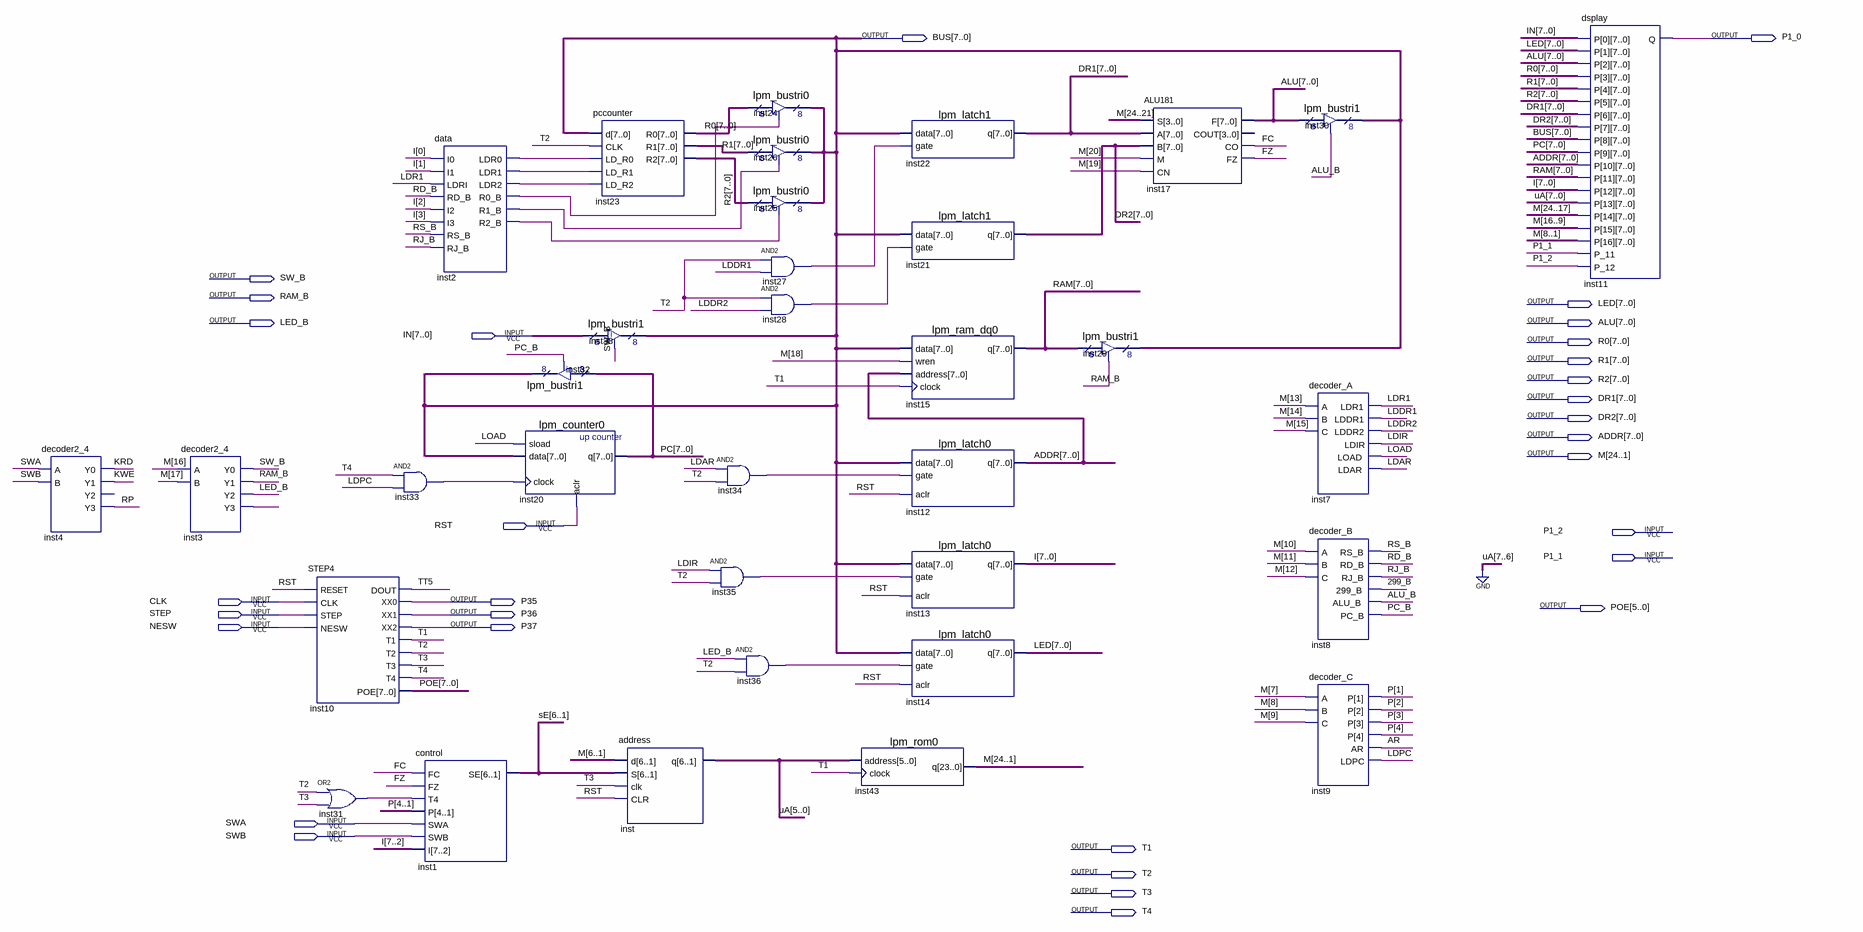
[diagram p0: schematic sheet]
// Quartus schematic cpu.bdf as structural Verilog: 34 symbols, 31 pins
module cpu (
  input  [7:0] IN,
  input  RST,
  input  P1_2,
  input  P1_1,
  input  CLK,
  input  STEP,
  input  NESW,
  input  SWA,
  input  SWB,
  output [7:0] BUS,
  output P1_0,
  output SW_B,
  output RAM_B,
  output [7:0] LED,
  output LED_B,
  output [7:0] ALU,
  output [7:0] R0,
  output [7:0] R1,
  output [7:0] R2,
  output [7:0] DR1,
  output [7:0] DR2,
  output [7:0] ADDR,
  output [24:1] M,
  output P35,
  output [7:0] POE,
  output P36,
  output P37,
  output T1,
  output T2,
  output T3,
  output T4
);

  wire \299_B , ALU_B, AR, FC, FZ, inst2_ldr0, inst2_ldr1, inst2_ldr2, inst2_r0_b, inst2_r1_b, inst2_r2_b,
       inst3_y3, inst27_out, inst28_out, inst31_out, inst33_out, inst34_out, inst35_out, inst36_out, KRD,
       KWE, LDAR, LDDR1, LDDR2, LDIR, LDPC, LDR1, LOAD, PC_B, RD_B, RJ_B, RP, RS_B, TT5;
  wire [4:1] P;
  wire [5:0] uA;
  wire [6:1] sE;
  wire [7:0] I, PC, RAM;

  decoder2_4 inst4 (.A(SWA), .B(SWB), .Y0(KRD), .Y1(KWE), .Y3(RP));  // open: Y2
  decoder2_4 inst3 (.A(M[16]), .B(M[17]), .Y0(SW_B), .Y1(RAM_B), .Y2(LED_B), .Y3(inst3_y3));
  STEP4 inst10 (
    .RESET(RST), .CLK(CLK), .STEP(STEP), .NESW(NESW), .DOUT(TT5), .XX0(P35), .XX1(P36), .XX2(P37), .T1(T1),
    .T2(T2), .T3(T3), .T4(T4), .POE(POE));
  or inst31 (inst31_out, T2, T3);
  and inst33 (inst33_out, T4, LDPC);
  control inst1 (.FC(FC), .FZ(FZ), .T4(inst31_out), .P(P), .SWA(SWA), .SWB(SWB), .I(I[7:2]), .SE(sE));
  data inst2 (
    .I0(I[0]), .I1(I[1]), .LDRI(LDR1), .RD_B(RD_B), .I2(I[2]), .I3(I[3]), .RS_B(RS_B), .RJ_B(RJ_B),
    .LDR0(inst2_ldr0), .LDR1(inst2_ldr1), .LDR2(inst2_ldr2), .R0_B(inst2_r0_b), .R1_B(inst2_r1_b),
    .R2_B(inst2_r2_b));
  lpm_counter0 inst20 (.sload(LOAD), .data(BUS), .clock(inst33_out), .aclr(RST), .q(PC));
  lpm_bustri1 inst32 (.enabledt(PC_B), .data(PC), .tridata(BUS));
  pccounter inst23 (
    .d(BUS), .CLK(T2), .LD_R0(inst2_ldr0), .LD_R1(inst2_ldr1), .LD_R2(inst2_ldr2), .R0(R0), .R1(R1), .R2(R2));
  lpm_bustri1 inst38 (.enabledt(SW_B), .data(IN), .tridata(BUS));
  address inst (.d(M[6:1]), .S(sE), .clk(T3), .CLR(RST), .q(uA));
  and inst34 (inst34_out, LDAR, T2);
  and inst35 (inst35_out, LDIR, T2);
  lpm_bustri0 inst24 (.enabledt(inst2_r0_b), .data(R0), .tridata(BUS));
  lpm_bustri0 inst26 (.enabledt(inst2_r1_b), .data(R1), .tridata(BUS));
  lpm_bustri0 inst25 (.enabledt(inst2_r2_b), .data(R2), .tridata(BUS));
  and inst27 (inst27_out, T2, LDDR1);
  and inst28 (inst28_out, T2, LDDR2);
  and inst36 (inst36_out, LED_B, T2);
  lpm_rom0 inst43 (.address(uA), .clock(T1), .q(M));
  lpm_latch1 inst22 (.data(BUS), .gate(inst27_out), .q(DR1));
  lpm_latch1 inst21 (.data(BUS), .gate(inst28_out), .q(DR2));
  lpm_ram_dq0 inst15 (.data(BUS), .wren(M[18]), .address(ADDR), .clock(T1), .q(RAM));
  lpm_latch0 inst12 (.data(BUS), .gate(inst34_out), .aclr(RST), .q(ADDR));
  lpm_latch0 inst13 (.data(BUS), .gate(inst35_out), .aclr(RST), .q(I));
  lpm_latch0 inst14 (.data(BUS), .gate(inst36_out), .aclr(RST), .q(LED));
  lpm_bustri1 inst29 (.enabledt(RAM_B), .data(RAM), .tridata(BUS));
  ALU181 inst17 (.S(M[24:21]), .A(DR1), .B(DR2), .M(M[20]), .CN(M[19]), .F(ALU), .CO(FC), .FZ(FZ));  // open: COUT
  lpm_bustri1 inst30 (.enabledt(ALU_B), .data(ALU), .tridata(BUS));
  decoder_A inst7 (
    .A(M[13]), .B(M[14]), .C(M[15]), .LDR1(LDR1), .LDDR1(LDDR1), .LDDR2(LDDR2), .LDIR(LDIR), .LOAD(LOAD),
    .LDAR(LDAR));
  decoder_B inst8 (
    .A(M[10]), .B(M[11]), .C(M[12]), .RS_B(RS_B), .RD_B(RD_B), .RJ_B(RJ_B), .\299_B (\299_B ), .ALU_B(ALU_B),
    .PC_B(PC_B));
  decoder_C inst9 (.A(M[7]), .B(M[8]), .C(M[9]), .P(P), .AR(AR), .LDPC(LDPC));
  dsplay inst11 (
    .P_0(IN), .P_1(LED), .P_2(ALU), .P_3(R0), .P_4(R1), .P_5(R2), .P_6(DR1), .P_7(DR2), .P_8(BUS), .P_9(PC),
    .P_10(ADDR), .P_11({RAM, P1_1}), .P_12({I, P1_2}), .P_13({2'b00, uA}), .P_14(M[24:17]), .P_15(M[16:9]),
    .P_16(M[8:1]), .Q(P1_0));
endmodule
